# Altium schematic sheet POWER.schdoc
size 508 x 254 mm; SheetNumber: 1; SheetTotal: 1
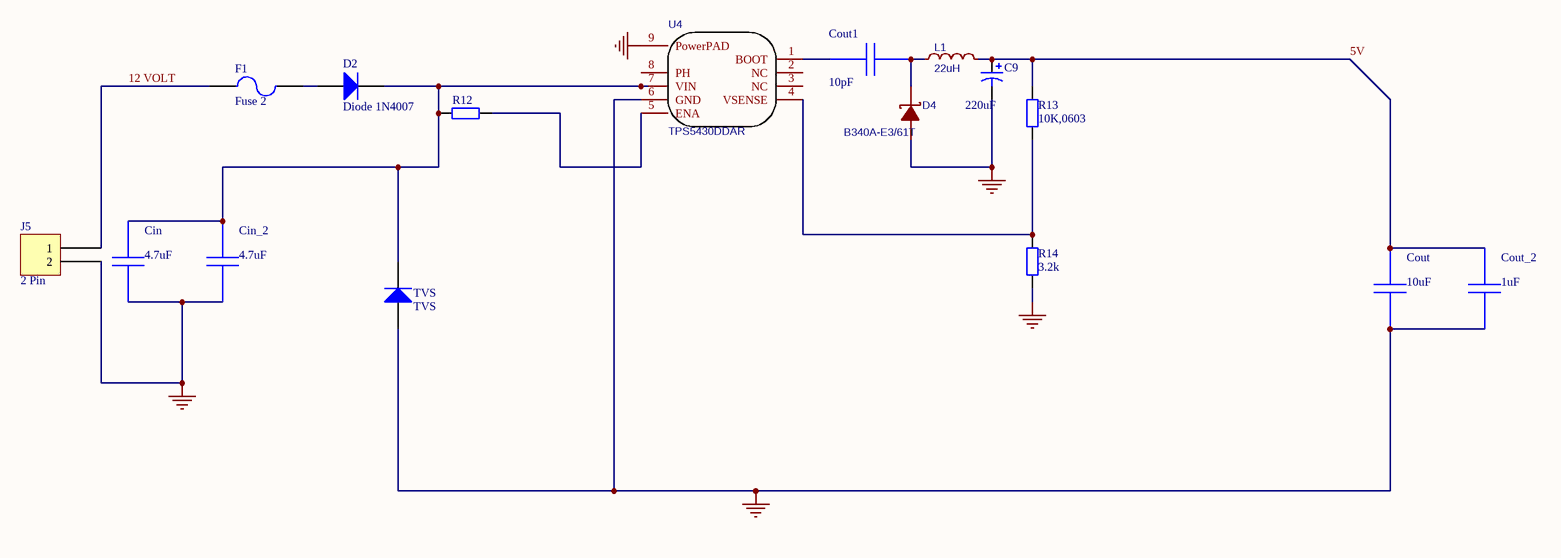
[diagram p0: POWER.schdoc]

## Parts
C9  value 220uF  [1206]  (hidden comment: Cap Pol3)
Cin  value 4.7uF  [1206]  (hidden comment: GRM32ER71J106KA12L)
Cin_2  value 4.7uF  [1206]  (hidden comment: GRM32ER71J106KA12L)
Cout  value 10uF  [1206]  (hidden comment: C1608X5R1A226M080AC)
Cout1  value 10pF  [1206]  (hidden comment: C1608X5R1A226M080AC)
Cout_2  value 1uF  [1206]  (hidden comment: C1608X5R1A226M080AC)
D2  Diode 1N4007  [SMA(DO-214AC)]
D4  B340A-E3/61T  [SMA(DO-214AC)]
F1  Fuse 2  [1206]
J5  2 Pin  [HDR1X2]
L1  22uH  [l7070]
R12  (no value)  [0805]
R13  10K,0603  [0805]
R14  3.2k  [0805]
TVS  TVS  [SMA(DO-214AC)]
U4  TPS5430DDAR  [SOP-8_EP_150MIL]

## Nets
0: C9.2 Cin.2 Cin_2.2 Cout.2 Cout_2.2 D4.1(A) J5.2 R14.1 TVS.1(A) U4.6(GND) U4.9(PowerPAD)
5V: C9.1 Cout.1 Cout_2.1 L1.2 R13.2
12 VOLT: F1.1 J5.1
NetCin_1: Cin.1 Cin_2.1 D2.2(K) R12.2 TVS.2(K) U4.7(VIN)
NetCout1_1: Cout1.1 U4.1(BOOT)
NetCout1_2: Cout1.2 D4.2(K) L1.1
NetD2_1: D2.1(A) F1.2
NetR12_1: R12.1 U4.5(ENA)
NetR13_1: R13.1 R14.2 U4.4(VSENSE)

Not connected (* = marked no-connect by the designer): U4 2(NC) 3(NC) 8(PH)

## Library data of the parts
C9 = Cap Pol3: Polarized Capacitor (Surface Mount); Published: 8-Jun-2000; LatestRevisionDate: 29-May-2009; LatestRevisionNote: IPC-7351 Footprint Added.; PackageReference: C0805; Publisher: Altium Limited; PackageDescription: Chip Capacitor
Cin Cin_2 = GRM32ER71J106KA12L: GRM32ER71J106KA1; Manufacturer Name: MuRata; PackageReference: GRM32ER71J106KA12L; Manufacturer Part Number: GRM32ER71J106KA12L
Cout Cout1 Cout_2 = C1608X5R1A226M080AC: C1608X5R1A226M08; Manufacturer Name: TDK; PackageReference: C1608X5R1A226M080AC; Manufacturer Part Number: C1608X5R1A226M080AC
D2 TVS = Diode 1N4007: 1 Amp General Purpose Rectifier; Published: 8-Jun-2000; LatestRevisionDate: 17-Jul-2002; LatestRevisionNote: Re-released for DXP Platform.; DatasheetVersion: 1998; PackageVersion: Aug-1999; PackageReference: DO-41; Publisher: Altium Limited; PackageDescription: Diode, Axial; Body 5.2 x 2.7 mm (LxDia. max), Lead Dia. 0.86 mm (max); Code_JEDEC: DO-204-AL; ComponentLink1Description: Manufacturer Link; ComponentLink1URL: http://www.fairchildsemi.com/; ComponentLink2Description: Datasheet; ComponentLink2URL: http://www.fairchildsemi.com/ds/1N%2F1N4001.pdf
D4 = B340A-E3/61T: BOM_Manufacturer: VISHAY; BOM_Supplier: LCSC; BOM_Manufacturer Part: B340A-E3/61T; image: //image.lceda.cn/szlcsc/C15570.jpg; BOM_Supplier Part: C15570; spicePre: D
F1 = Fuse 2: Fuse; Published: 8-Jun-2000; LatestRevisionDate: 17-Jul-2002; LatestRevisionNote: Re-released for DXP Platform.; PackageReference: PIN-W2/E2.8; Publisher: Altium Limited; PackageDescription: Thru-Hole; 2 Leads
L1 = 100uH: BOM_Manufacturer: TAITEC; BOM_Manufacturer Part: NLV32T-150J-PF; nameAlias: Inductance; Contributor: LCSC; BOM_Supplier: LCSC; BOM_Supplier Part: C304294; spicePre: L; spiceSymbolName: FPI0705F-101M
R12-R14 = Res2: Resistor; Published: 8-Jun-2000; LatestRevisionDate: 17-Jul-2002; LatestRevisionNote: Re-released for DXP Platform.; Publisher: Altium Limited
U4 = TPS5430DDAR: BOM_Manufacturer: TI; BOM_Supplier: LCSC; BOM_Manufacturer Part: TPS5430DDAR; BOM_LCSC Assembly: Yes; image: //image.lceda.cn/szlcsc/C9864.jpg; BOM_Supplier Part: C9864; spicePre: U